# EasyEDA Pro project Hand-Exoskeleton-for-Climbing.epro

# Schematic Schematic1
Board Name: Board1; Create Date: 2025-05-13; Page Name: P1; Project Name: 设计与制造Ⅱ; Schematic Name: Schematic1; Update Date: 2025-05-13; Company: 嘉立创EDA; Page Size: A4; Version: V1.0
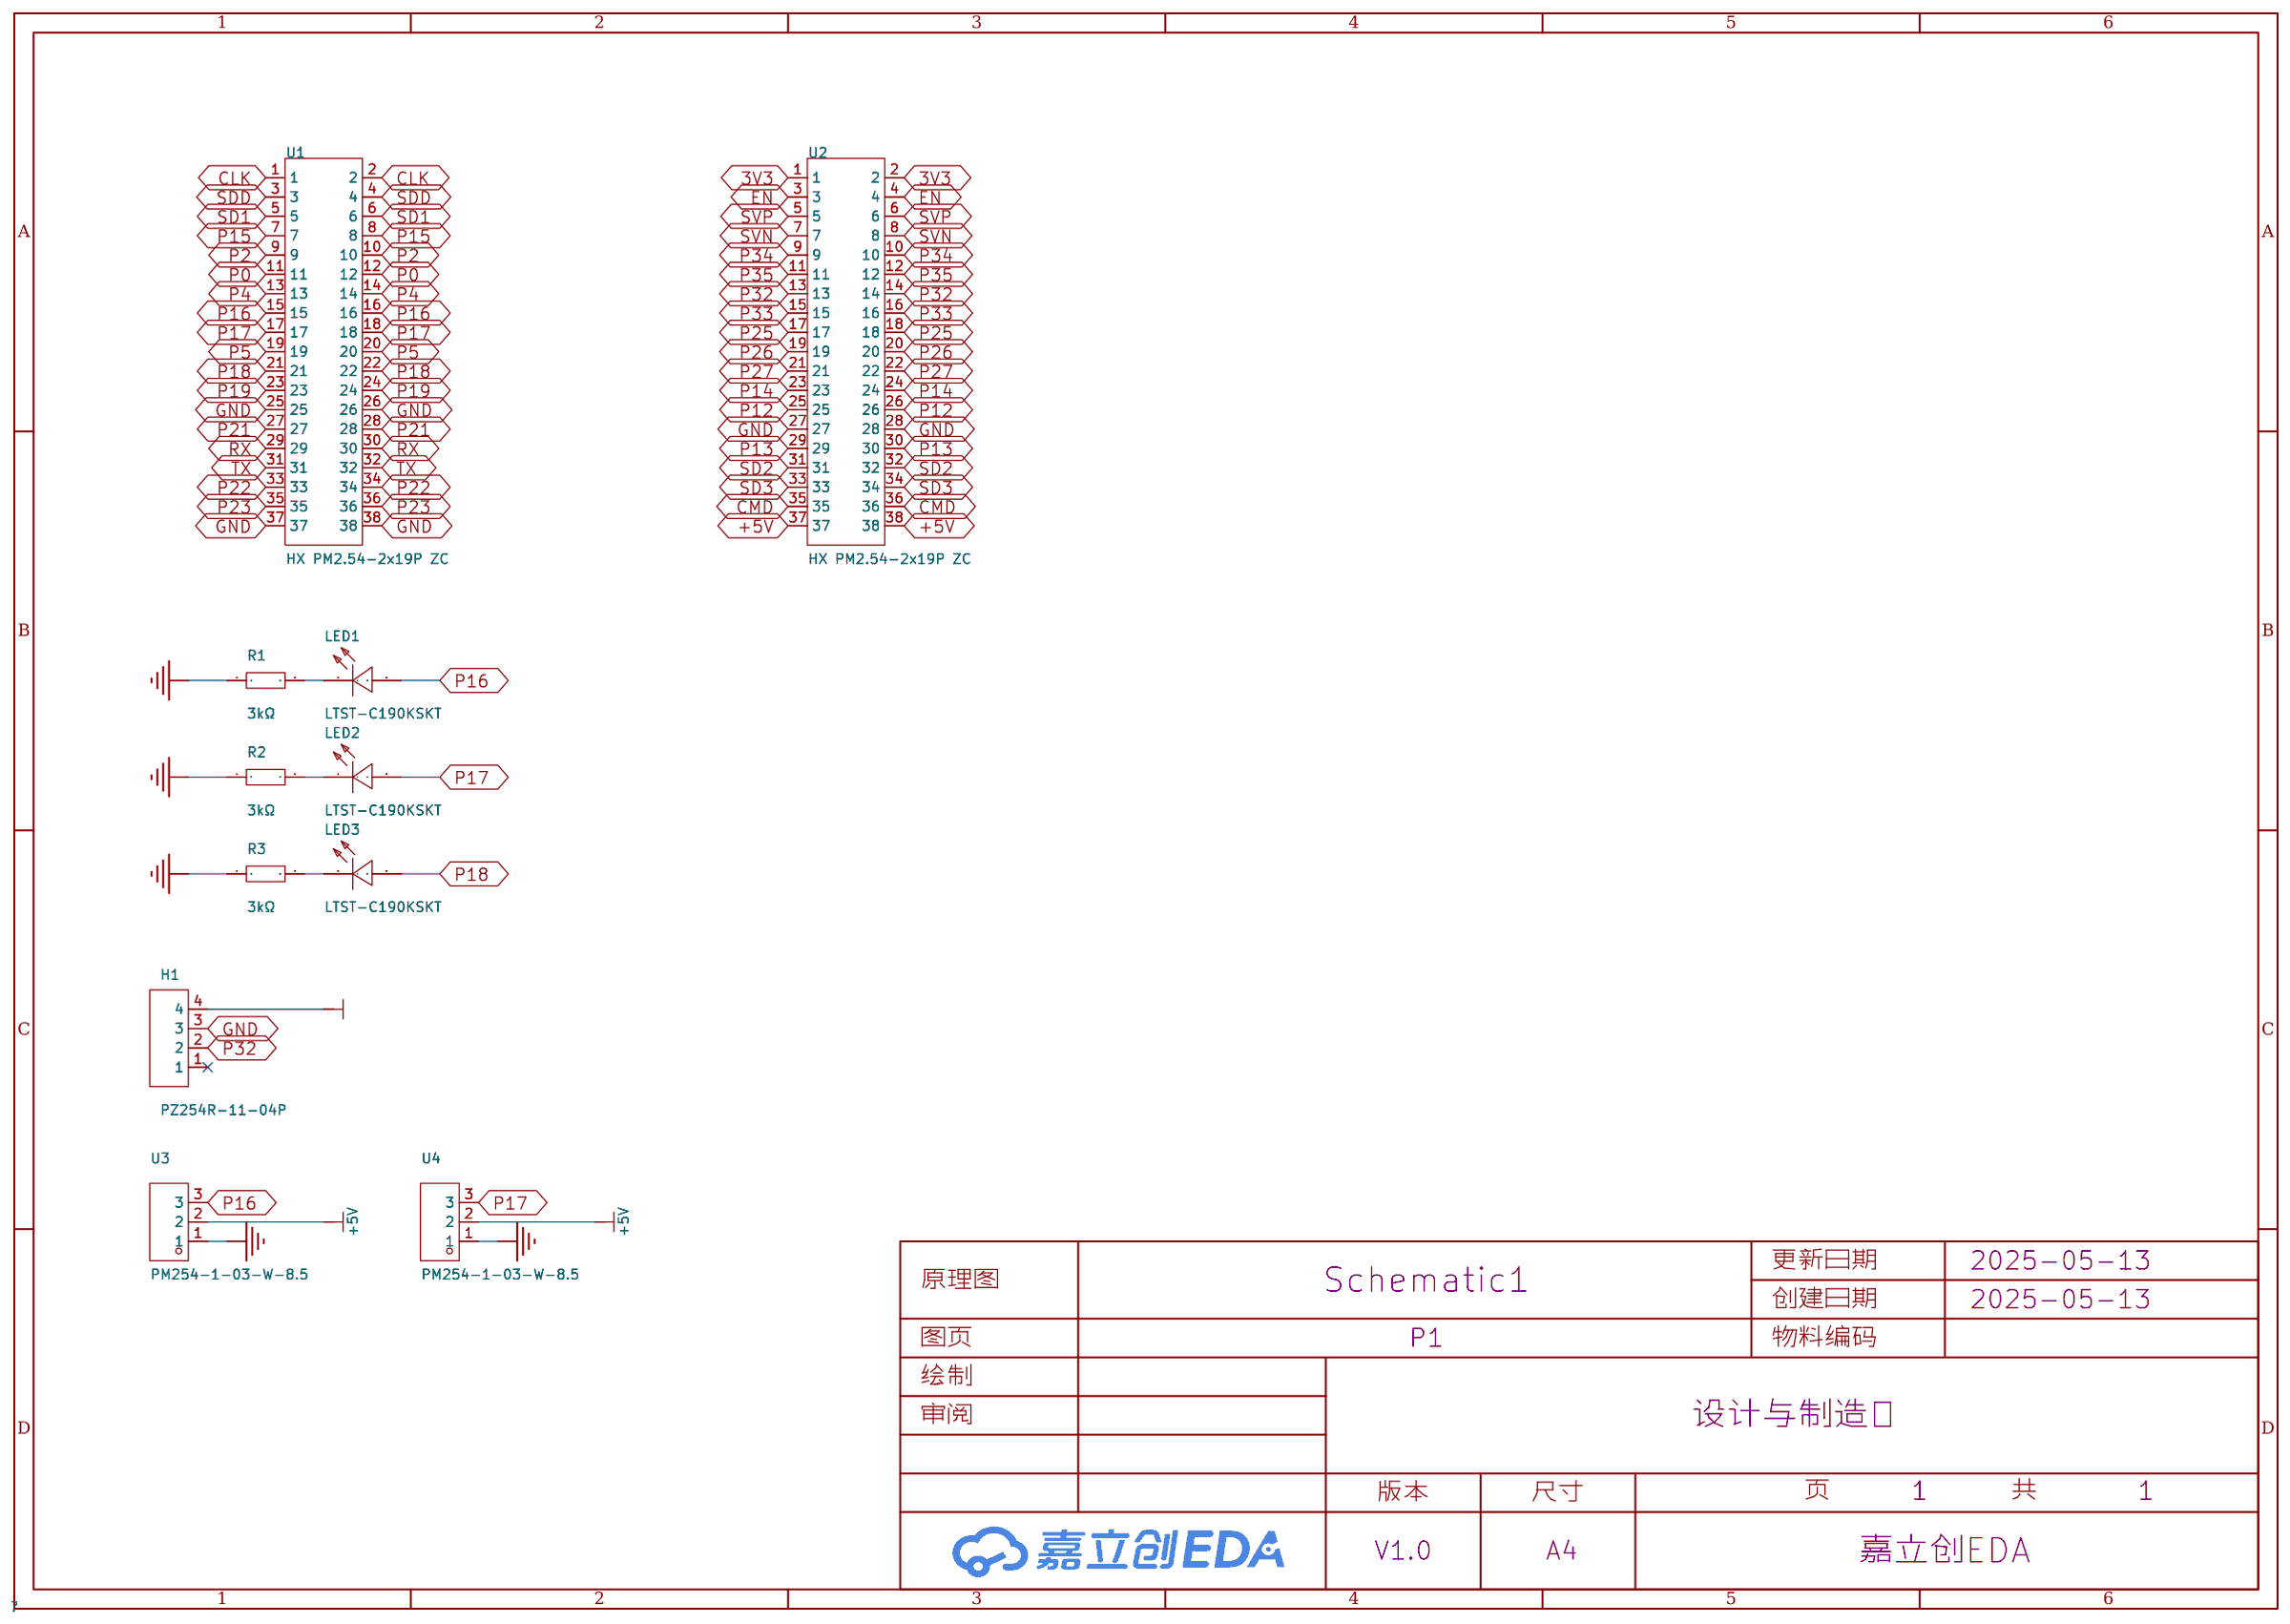
[diagram p0: schematic sheet]

## Parts
H1  PZ254R-11-04P  [HDR-TH_4P-P2.54-H-M-W10.4]
LED1  LTST-C190KSKT  [LED0603-RD]
LED2  LTST-C190KSKT  [LED0603-RD]
LED3  LTST-C190KSKT  [LED0603-RD]
R1  3kΩ  [R0603]
R2  3kΩ  [R0603]
R3  3kΩ  [R0603]
U1  HX PM2.54-2x19P ZC  [HDR-TH_38P-P2.54-V-F-R2-C19-S2.54-1]
U2  HX PM2.54-2x19P ZC  [HDR-TH_38P-P2.54-V-F-R2-C19-S2.54-1]
U3  PM254-1-03-W-8.5  [HDR-TH_3P-P2.54-H-F-W10.0-N]
U4  PM254-1-03-W-8.5  [HDR-TH_3P-P2.54-H-F-W10.0-N]

## Library data of the parts
H1 = PZ254R-11-04P: 插针结构:1x4P;间距:2.54mm;行距:-;圆针/方针:方针;安装方式:弯插;排数:单排;总PIN位数:4P;额定电流:-;额定电压:-;配合针长度:6mm;塑高:2.5mm;触头材质:黄铜;触头镀层:-;工作温度:-40℃~+105℃;颜色:黑色;; LCSC Part Name: 1x4P 间距:2.54mm 方针 弯插; Supplier Part: C492412; Manufacturer: XFCN(兴飞); Supplier Footprint: 弯插,P=2.54mm; JLCPCB Part Class: 扩展库; Datasheet: https://atta.szlcsc.com/upload/public/pdf/source/20200309/C492412_B0EFFC1946AB079B8871416C4A09EF6C.pdf; Supplier: LCSC; Pin Structure: 1x4P; Pitch: 2.54mm; Circluar Pins/Square Pins: 方针; Mounting Type: 弯插; Number of Rows: 单排; Number of Pins: 4P; Length of Mating Pin: 6mm; Insulation Height: 2.5mm; Contact Material: 黄铜; Operating Temperature: -40℃~+105℃; Color: 黑色
LED1-LED3 = LTST-C190KSKT: 发光颜色:黄色;正向电压(VF):2.1V;功率:75mW;正向电流:20mA;主波长:584.5nm~597nm;二极管配置:-;透镜颜色:无色透明透镜;色温:-;发光强度:104mcd;发光角度:130°;载带方式:-;工作温度:-30℃~+85℃;; LCSC Part Name: 黄灯; Supplier Part: C125095; Manufacturer: LITEON(光宝); Supplier Footprint: 0603; JLCPCB Part Class: 扩展库; Datasheet: https://atta.szlcsc.com/upload/public/pdf/source/20180129/C125095_15171881843821315881.pdf; Supplier: LCSC; Emitted Color: 黄色; Forward Voltage (VF): 2.1V; Power Dissipation: 75mW; Forward Current: 20mA; Dominant Wavelength: 584.5nm~597nm; Peak Wavelength: 588nm; Lens Color: 无色透明透镜; Luminous Intensity: 104mcd; Viewing Angle: 130°; Operating Temperature: -30℃~+85℃
R1-R3 = 0603WAF3001T5E: 电阻类型:厚膜电阻;阻值:3kΩ;精度:±1%;功率:100mW;工作电压:75V;温度系数:±100ppm/℃;; LCSC Part Name: 3kΩ ±1% 100mW 厚膜电阻; Supplier Part: C4211; Manufacturer: UNI-ROYAL(厚声); Supplier Footprint: 0603; JLCPCB Part Class: 基础库; Datasheet: https://atta.szlcsc.com/upload/public/pdf/source/20200306/C422600_1E6D84923E4A46A82E41ADD87F860B5C.pdf; Supplier: LCSC; Type: 厚膜电阻; Tolerance: ±1%; Power(Watts): 100mW; Voltage-Supply(Max): 75V; Temperature Coefficient: ±100ppm/℃; Operating Temperature: -55℃~+155℃
U1 U2 = HX PM2.54-2x19P ZC: 插孔结构:2x19P;间距:2.54mm;行距:2.54mm;圆孔/方孔:方孔;安装方式:直插;排数:双排;总孔位数:38P;额定电流:3A;插孔方向:顶部;塑高:8.5mm;触头镀层:金;工作温度:-40℃~+105℃;; LCSC Part Name: 间距：2.54mm 2x19P 直插排母; Supplier Part: C42372543; Manufacturer: hanxia(韩下); Supplier Footprint: 插件,P=2.54mm; Datasheet: https://atta.szlcsc.com/upload/public/pdf/source/20241030/2B81E1E23C986D3D2A350FD3367BFA9F.pdf; Supplier: LCSC; Holes Structure: 2x19P; Pitch: 2.54mm; Row Spacing: 2.54mm; Circular Hole / Square Hole: 方孔; Mounting Type: 直插; Number of Rows: 双排; Number of Positions: 38P; Current Rating: 3A; Holes Direction: 顶部; Insulation Height: 8.5mm; Contact Plating: 金; Operating Temperature: -40℃~+105℃; PIN Length: 3.2mm
U3 U4 = PM254-1-03-W-8.5: 插孔结构:1x3P;间距:2.54mm;行距:-;圆孔/方孔:方孔;安装类型:弯插;排数:单排;总孔位数:3P;额定电流:3A;额定电压:-;插孔方向:侧面;塑高:8.5mm;触头材质:铜合金;工作温度范围:-40℃~+105℃;焊接温度(最大值):260℃@5S;; LCSC Part Name: 1x3P 间距:2.54mm 弯插; Supplier Part: C2897385; Manufacturer: HCTL(华灿天禄); Supplier Footprint: 弯插,P=2.54mm; JLCPCB Part Class: 扩展库; Datasheet: https://atta.szlcsc.com/upload/public/pdf/source/20230609/7BA40A3D721268A082DCDEAD4C99131B.pdf; Supplier: LCSC; Holes Structure: 1x3P; Pitch: 2.54mm; Circular Hole / Square Hole: 方孔; Mounting Type: 弯插; Number of Rows: 单排; Number of Holes: 3P; Current Rating (Max): 3A; Holes Direction: 侧面; Insulation Height: 8.5mm; Contact Material: 铜合金; Operating Temperature Range: -40℃~+105℃; Soldering Temperature(Max): 260℃@5S

## Nets
3V3: H1.4 U2.1 U2.2
+5V: U2.37 U2.38 U3.2 U4.2
GND: H1.3 R1.1 R2.1 R3.1 U1.25 U1.26 U1.37 U1.38 U2.27 U2.28 U3.1 U4.1
CLK: U1.1 U1.2
CMD: U2.35 U2.36
EN: U2.3 U2.4
P0: U1.11 U1.12
P2: U1.9 U1.10
P4: U1.13 U1.14
P5: U1.19 U1.20
P12: U2.25 U2.26
P13: U2.29 U2.30
P14: U2.23 U2.24
P15: U1.7 U1.8
P16: LED1.2(+) U1.15 U1.16 U3.3
P17: LED2.2(+) U1.17 U1.18 U4.3
P18: LED3.2(+) U1.21 U1.22
P19: U1.23 U1.24
P21: U1.27 U1.28
P22: U1.33 U1.34
P23: U1.35 U1.36
P25: U2.17 U2.18
P26: U2.19 U2.20
P27: U2.21 U2.22
P32: H1.2 U2.13 U2.14
P33: U2.15 U2.16
P34: U2.9 U2.10
P35: U2.11 U2.12
RX: U1.29 U1.30
SD1: U1.5 U1.6
SD2: U2.31 U2.32
SD3: U2.33 U2.34
SDD: U1.3 U1.4
SVN: U2.7 U2.8
SVP: U2.5 U2.6
TX: U1.31 U1.32
$1N1874: LED1.1(-) R1.2
$1N1990: LED2.1(-) R2.2
$1N2241: LED3.1(-) R3.2

Not connected (* = marked no-connect by the designer): H1 1*

# Board PCB1
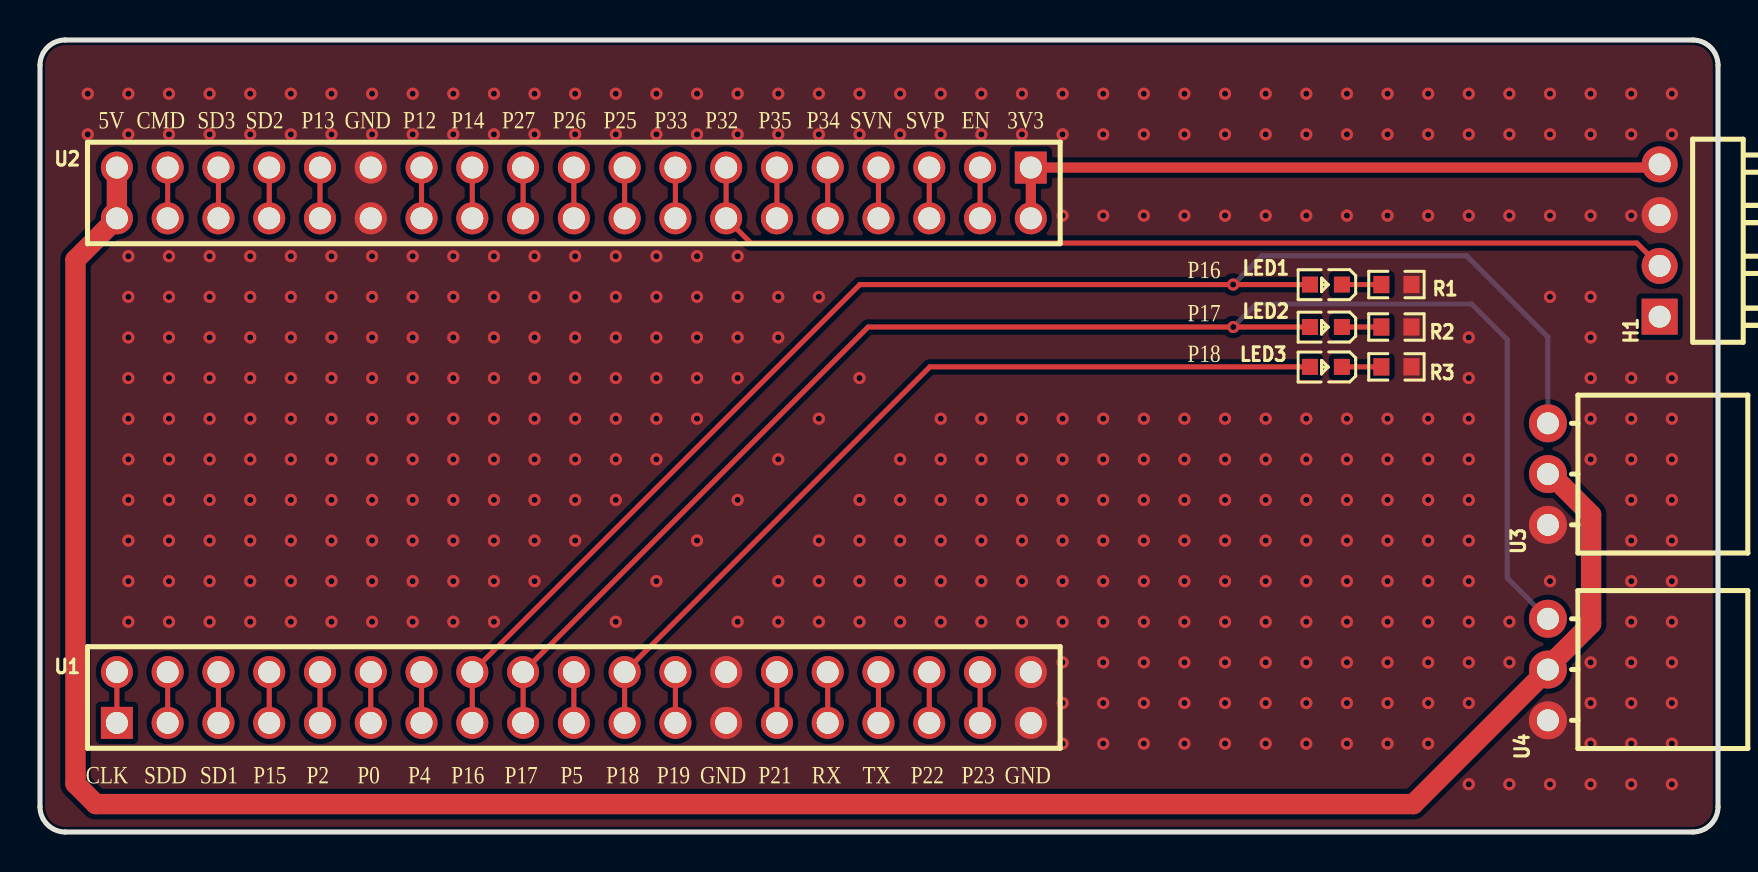
[diagram p1: board, top side]
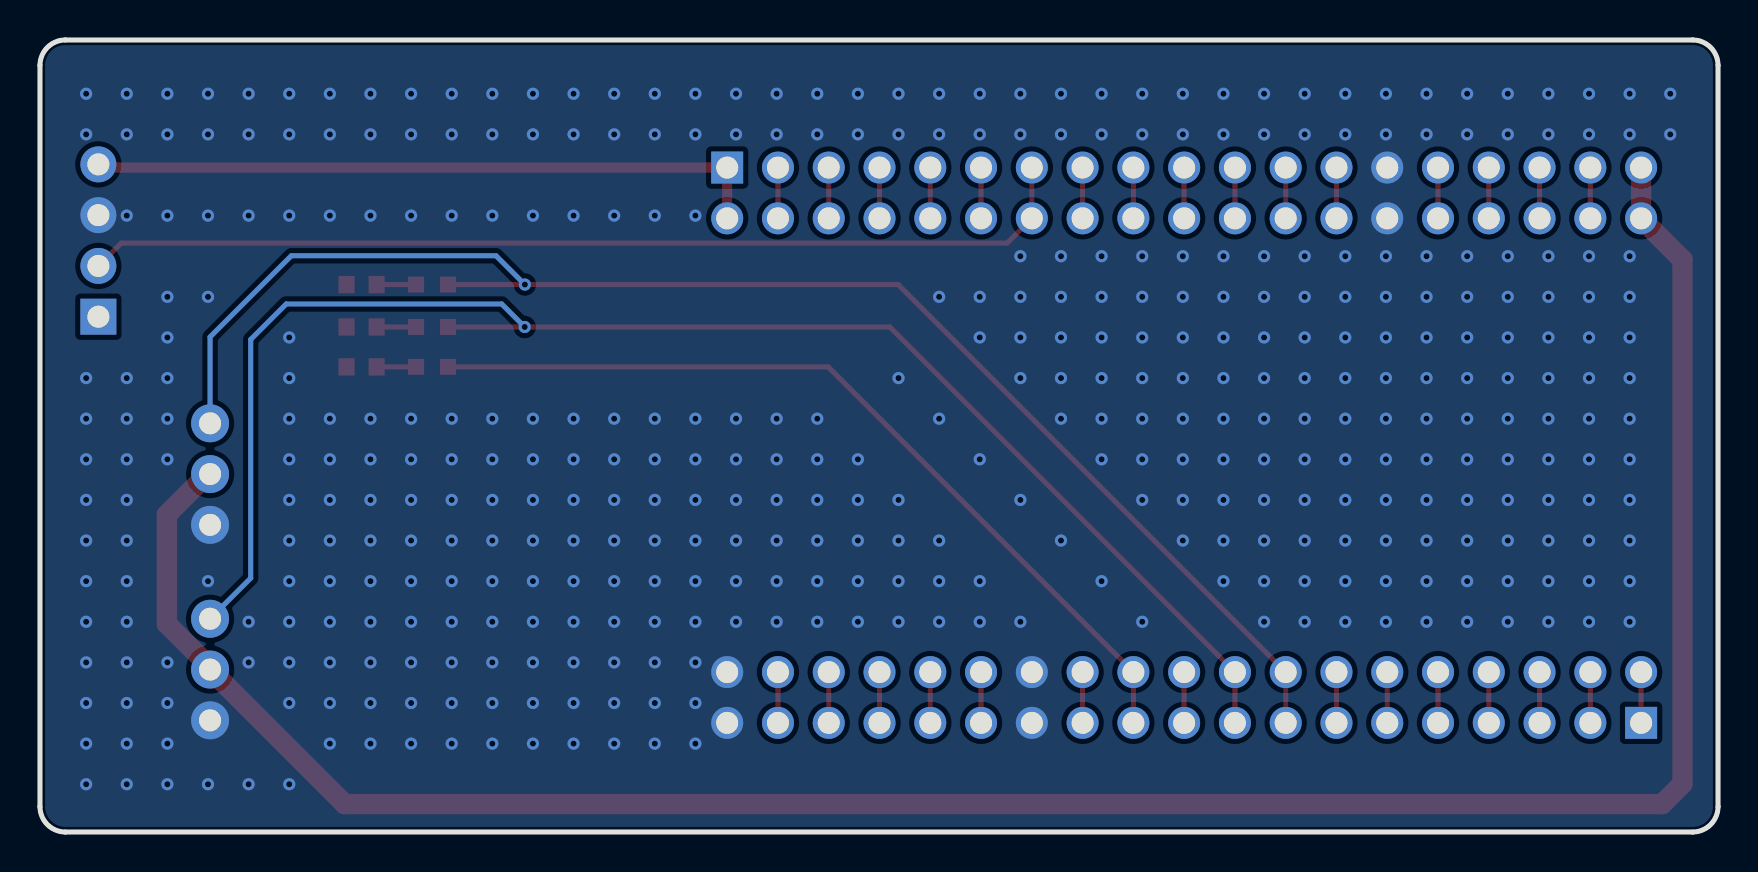
[diagram p2: board, bottom side, seen from below]

Outline 83.95 x 39.62 mm; copper layers: Top Layer, Bottom Layer. Coordinates in mm from the lower left corner of the outline.
Outline path: 0,38.35 0,1.27 arc(0.37,0.37) 1.27,0 82.68,0 arc(83.58,0.37) 83.95,1.27 83.95,38.35 arc(83.58,39.25) 82.68,39.62 1.27,39.62 arc(0.37,39.25) 0,38.35
Stack: Top Layer 0.035mm / Dielectric1 1.51mm FR4 er 4.5 / Bottom Layer 0.035mm

## Design rules (mm)
template: 直连铺铜
spacing copperThickness1oz (default): track to track 0.102, other pairs 0.152 to 0.3
spacing copperThickness2oz: track to track 0.203, other pairs 0.152 to 0.3
track width copperThickness1oz (default): min 0.127, default 0.254, max 2.54
track width copperThickness2oz: min 0.203, default 0.254, max 2.54
differential pair differentialPair (default): width min 0.127, default 0.254, max 2.54; gap min 0.152, default 0.152
via viaSize (default): diameter min 0.5, default 0.61, max 10; hole min 0.3, default 0.305, max 6.3

## Placement (name value [footprint] x y rotation side)
H1  PZ254R-11-04P  [HDR-TH_4P-P2.54-H-M-W10.4]  81.03 29.59 90 top
LED1  LTST-C190KSKT  [LED0603-RD]  64.33 27.39 180 top
LED2  LTST-C190KSKT  [LED0603-RD]  64.33 25.27 180 top
LED3  LTST-C190KSKT  [LED0603-RD]  64.33 23.27 180 top
R1  3kΩ  [R0603]  67.86 27.39 180 top
R2  3kΩ  [R0603]  67.86 25.27 180 top
R3  3kΩ  [R0603]  67.86 23.27 180 top
U1  HX PM2.54-2x19P ZC  [HDR-TH_38P-P2.54-V-F-R2-C19-S2.54-1]  26.71 6.73 0 top
U2  HX PM2.54-2x19P ZC  [HDR-TH_38P-P2.54-V-F-R2-C19-S2.54-1]  26.71 31.97 180 top
U3  PM254-1-03-W-8.5  [HDR-TH_3P-P2.54-H-F-W10.0-N]  75.44 17.91 90 top
U4  PM254-1-03-W-8.5  [HDR-TH_3P-P2.54-H-F-W10.0-N]  75.44 8.13 90 top

## Footprints (pads in the part's own frame, mm; a bottom-side part is the same pattern mirrored in y, then rotated)
HDR-TH_3P-P2.54-H-F-W10.0-N
  round 1.9 hole 1.1: 1(-2.54,0) 2(0,0) 3(2.54,0)
HDR-TH_4P-P2.54-H-M-W10.4
  rect 1.8x1.8 hole 1.1: 1(-3.81,0)
  round 1.8 hole 1.1: 2(-1.27,0) 3(1.27,0) 4(3.81,0)
HDR-TH_38P-P2.54-V-F-R2-C19-S2.54-1
  rect 1.6x1.6 hole 1.1: 1(-22.86,-1.27)
  round 1.6 hole 1.1: 2(-22.86,1.27) 3(-20.32,-1.27) 4(-20.32,1.27) 5(-17.78,-1.27) 6(-17.78,1.27) 7(-15.24,-1.27) 8(-15.24,1.27) 9(-12.7,-1.27) 10(-12.7,1.27) 11(-10.16,-1.27) 12(-10.16,1.27) 13(-7.62,-1.27) 14(-7.62,1.27) 15(-5.08,-1.27) 16(-5.08,1.27) 17(-2.54,-1.27) 18(-2.54,1.27) 19(0,-1.27) 20(0,1.27) 21(2.54,-1.27) 22(2.54,1.27) 23(5.08,-1.27) 24(5.08,1.27) 25(7.62,-1.27) 26(7.62,1.27) 27(10.16,-1.27) 28(10.16,1.27) 29(12.7,-1.27) 30(12.7,1.27) 31(15.24,-1.27) 32(15.24,1.27) 33(17.78,-1.27) 34(17.78,1.27) 35(20.32,-1.27) 36(20.32,1.27) 37(22.86,-1.27) 38(22.86,1.27)
LED0603-RD
  rect 0.8x0.8 smd: 1(-0.799,0) 2(0.799,0)
R0603
  rect 0.806x0.864 smd: 1(-0.753,0) 2(0.753,0)

## Nets
As in the schematic.

Pads without a net: H1 1

## Via types
v1: diameter 0.61, hole 0.305, Top Layer to Bottom Layer, 417 vias

## Routing (per net, layer and track width the routed paths; a pad name or vN(x,y) marks a point on that pad's centre or on a via; arc(x,y) is an arc through that point)
3V3: length 34.1
  Top Layer w0.508: U2.2 U2.1 80.87,33.24 H1.4
+5V: length 120.2
  Top Layer w1.016: U3.2 75.57,17.91 77.6,15.88 77.6,10.41 75.44,8.26 U4.2 68.71,1.4 2.79,1.4 1.78,2.41 1.78,28.63 U2.38 U2.37
GND:
  vias: v1(2.39,36.93) v1(2.39,34.9) v1(4.42,36.93) v1(4.42,34.9) v1(4.42,28.81) v1(4.42,26.77) v1(4.42,24.74) v1(4.42,22.71) v1(4.42,20.68) v1(4.42,18.65) v1(4.42,16.61) v1(4.42,14.58) v1(4.42,12.55) v1(4.42,10.52) v1(6.45,36.93) v1(6.45,34.9) v1(6.45,28.81) v1(6.45,26.77) v1(6.45,24.74) v1(6.45,22.71) v1(6.45,20.68) v1(6.45,18.65) v1(6.45,16.61) v1(6.45,14.58) v1(6.45,12.55) v1(6.45,10.52) v1(8.49,36.93) v1(8.49,34.9) v1(8.49,28.81) v1(8.49,26.77) v1(8.49,24.74) v1(8.49,22.71) v1(8.49,20.68) v1(8.49,18.65) v1(8.49,16.61) v1(8.49,14.58) v1(8.49,12.55) v1(8.49,10.52) v1(10.52,36.93) v1(10.52,34.9) v1(10.52,28.81) v1(10.52,26.77) v1(10.52,24.74) v1(10.52,22.71) v1(10.52,20.68) v1(10.52,18.65) v1(10.52,16.61) v1(10.52,14.58) v1(10.52,12.55) v1(10.52,10.52) v1(12.55,36.93) v1(12.55,34.9) v1(12.55,28.81) v1(12.55,26.77) v1(12.55,24.74) v1(12.55,22.71) v1(12.55,20.68) v1(12.55,18.65) v1(12.55,16.61) v1(12.55,14.58) v1(12.55,12.55) v1(12.55,10.52) v1(14.58,36.93) v1(14.58,34.9) v1(14.58,28.81) v1(14.58,26.77) v1(14.58,24.74) v1(14.58,22.71) v1(14.58,20.68) v1(14.58,18.65) v1(14.58,16.61) v1(14.58,14.58) v1(14.58,12.55) v1(14.58,10.52) v1(16.61,36.93) v1(16.61,34.9) v1(16.61,28.81) v1(16.61,26.77) v1(16.61,24.74) v1(16.61,22.71) v1(16.61,20.68) v1(16.61,18.65) v1(16.61,16.61) v1(16.61,14.58) v1(16.61,12.55) v1(16.61,10.52) v1(18.65,36.93) v1(18.65,34.9) v1(18.65,28.81) v1(18.65,26.77) v1(18.65,24.74) v1(18.65,22.71) v1(18.65,20.68) v1(18.65,18.65) v1(18.65,16.61) v1(18.65,14.58) v1(18.65,12.55) v1(18.65,10.52) v1(20.68,36.93) v1(20.68,34.9) v1(20.68,28.81) v1(20.68,26.77) v1(20.68,24.74) v1(20.68,22.71) v1(20.68,20.68) v1(20.68,18.65) v1(20.68,16.61) v1(20.68,14.58) v1(20.68,12.55) v1(20.68,10.52) v1(22.71,36.93) v1(22.71,34.9) v1(22.71,28.81) v1(22.71,26.77) v1(22.71,24.74) v1(22.71,22.71) v1(22.71,20.68) v1(22.71,18.65) v1(22.71,16.61) v1(22.71,14.58) v1(22.71,12.55) v1(22.71,10.52) v1(24.74,36.93) v1(24.74,34.9) v1(24.74,28.81) v1(24.74,26.77) v1(24.74,24.74) v1(24.74,22.71) v1(24.74,20.68) v1(24.74,18.65) v1(24.74,16.61) v1(24.74,14.58) v1(24.74,12.55) v1(26.77,36.93) v1(26.77,34.9) v1(26.77,28.81) v1(26.77,26.77) v1(26.77,24.74) v1(26.77,22.71) v1(26.77,20.68) v1(26.77,18.65) v1(26.77,16.61) v1(26.77,14.58) v1(28.81,36.93) v1(28.81,34.9) v1(28.81,28.81) v1(28.81,26.77) v1(28.81,24.74) v1(28.81,22.71) v1(28.81,20.68) v1(28.81,18.65) v1(28.81,16.61) v1(28.81,10.52) v1(30.84,36.93) v1(30.84,34.9) v1(30.84,28.81) v1(30.84,26.77) v1(30.84,24.74) v1(30.84,22.71) v1(30.84,20.68) v1(30.84,18.65) v1(30.84,12.55) v1(32.87,36.93) v1(32.87,34.9) v1(32.87,28.81) v1(32.87,26.77) v1(32.87,24.74) v1(32.87,22.71) v1(32.87,20.68) v1(32.87,14.58) v1(34.9,36.93) v1(34.9,34.9) v1(34.9,28.81) v1(34.9,26.77) v1(34.9,24.74) v1(34.9,22.71) v1(34.9,16.61) v1(34.9,10.52) v1(36.93,36.93) v1(36.93,34.9) v1(36.93,26.77) v1(36.93,24.74) v1(36.93,18.65) v1(36.93,12.55) v1(36.93,10.52) v1(38.97,36.93) v1(38.97,34.9) v1(38.97,26.77) v1(38.97,20.68) v1(38.97,14.58) v1(38.97,12.55) v1(38.97,10.52) v1(41,36.93) v1(41,34.9) v1(41,22.71) v1(41,16.61) v1(41,14.58) v1(41,12.55) v1(41,10.52) v1(43.03,36.93) v1(43.03,34.9) v1(43.03,18.65) v1(43.03,16.61) v1(43.03,14.58) v1(43.03,12.55) v1(43.03,10.52) v1(45.06,36.93) v1(45.06,34.9) v1(45.06,20.68) v1(45.06,18.65) v1(45.06,16.61) v1(45.06,14.58) v1(45.06,12.55) v1(45.06,10.52) v1(47.09,36.93) v1(47.09,34.9) v1(47.09,20.68) v1(47.09,18.65) v1(47.09,16.61) v1(47.09,14.58) v1(47.09,12.55) v1(47.09,10.52) v1(49.13,36.93) v1(49.13,34.9) v1(49.13,20.68) v1(49.13,18.65) v1(49.13,16.61) v1(49.13,14.58) v1(49.13,12.55) v1(49.13,10.52) v1(51.16,36.93) v1(51.16,34.9) v1(51.16,30.84) v1(51.16,20.68) v1(51.16,18.65) v1(51.16,16.61) v1(51.16,14.58) v1(51.16,12.55) v1(51.16,10.52) v1(51.16,8.49) v1(51.16,6.45) v1(51.16,4.42) v1(53.19,36.93) v1(53.19,34.9) v1(53.19,30.84) v1(53.19,20.68) v1(53.19,18.65) v1(53.19,16.61) v1(53.19,14.58) v1(53.19,12.55) v1(53.19,10.52) v1(53.19,8.49) v1(53.19,6.45) v1(53.19,4.42) v1(55.22,36.93) v1(55.22,34.9) v1(55.22,30.84) v1(55.22,20.68) v1(55.22,18.65) v1(55.22,16.61) v1(55.22,14.58) v1(55.22,12.55) v1(55.22,10.52) v1(55.22,8.49) v1(55.22,6.45) v1(55.22,4.42) v1(57.25,36.93) v1(57.25,34.9) v1(57.25,30.84) v1(57.25,20.68) v1(57.25,18.65) v1(57.25,16.61) v1(57.25,14.58) v1(57.25,12.55) v1(57.25,10.52) v1(57.25,8.49) v1(57.25,6.45) v1(57.25,4.42) v1(59.29,36.93) v1(59.29,34.9) v1(59.29,30.84) v1(59.29,20.68) v1(59.29,18.65) v1(59.29,16.61) v1(59.29,14.58) v1(59.29,12.55) v1(59.29,10.52) v1(59.29,8.49) v1(59.29,6.45) v1(59.29,4.42) v1(61.32,36.93) v1(61.32,34.9) v1(61.32,30.84) v1(61.32,20.68) v1(61.32,18.65) v1(61.32,16.61) v1(61.32,14.58) v1(61.32,12.55) v1(61.32,10.52) v1(61.32,8.49) v1(61.32,6.45) v1(61.32,4.42) v1(63.35,36.93) v1(63.35,34.9) v1(63.35,30.84) v1(63.35,20.68) v1(63.35,18.65) v1(63.35,16.61) v1(63.35,14.58) v1(63.35,12.55) v1(63.35,10.52) v1(63.35,8.49) v1(63.35,6.45) v1(63.35,4.42) v1(65.38,36.93) v1(65.38,34.9) v1(65.38,30.84) v1(65.38,20.68) v1(65.38,18.65) v1(65.38,16.61) v1(65.38,14.58) v1(65.38,12.55) v1(65.38,10.52) v1(65.38,8.49) v1(65.38,6.45) v1(65.38,4.42) v1(67.41,36.93) v1(67.41,34.9) v1(67.41,30.84) v1(67.41,20.68) v1(67.41,18.65) v1(67.41,16.61) v1(67.41,14.58) v1(67.41,12.55) v1(67.41,10.52) v1(67.41,8.49) v1(67.41,6.45) v1(67.41,4.42) v1(69.45,36.93) v1(69.45,34.9) v1(69.45,30.84) v1(69.45,20.68) v1(69.45,18.65) v1(69.45,16.61) v1(69.45,14.58) v1(69.45,12.55) v1(69.45,10.52) v1(69.45,8.49) v1(69.45,6.45) v1(69.45,4.42) v1(71.48,36.93) v1(71.48,34.9) v1(71.48,30.84) v1(71.48,24.74) v1(71.48,22.71) v1(71.48,20.68) v1(71.48,18.65) v1(71.48,16.61) v1(71.48,14.58) v1(71.48,12.55) v1(71.48,10.52) v1(71.48,8.49) v1(71.48,6.45) v1(71.48,2.39) v1(73.51,36.93) v1(73.51,34.9) v1(73.51,30.84) v1(73.51,10.52) v1(73.51,8.49) v1(73.51,2.39) v1(75.54,36.93) v1(75.54,34.9) v1(75.54,30.84) v1(75.54,26.77) v1(75.54,12.55) v1(75.54,2.39) v1(77.57,36.93) v1(77.57,34.9) v1(77.57,30.84) v1(77.57,26.77) v1(77.57,24.74) v1(77.57,22.71) v1(77.57,20.68) v1(77.57,18.65) v1(77.57,8.49) v1(77.57,6.45) v1(77.57,4.42) v1(77.57,2.39) v1(79.61,36.93) v1(79.61,34.9) v1(79.61,30.84) v1(79.61,22.71) v1(79.61,20.68) v1(79.61,18.65) v1(79.61,16.61) v1(79.61,14.58) v1(79.61,12.55) v1(79.61,10.52) v1(79.61,8.49) v1(79.61,6.45) v1(79.61,4.42) v1(79.61,2.39) v1(81.64,36.93) v1(81.64,34.9) v1(81.64,22.71) v1(81.64,20.68) v1(81.64,18.65) v1(81.64,16.61) v1(81.64,14.58) v1(81.64,12.55) v1(81.64,10.52) v1(81.64,8.49) v1(81.64,6.45) v1(81.64,4.42) v1(81.64,2.39)
CLK: length 2.5
  Top Layer w0.254: U1.2 U1.1
CMD: length 2.5
  Top Layer w0.254: U2.35 U2.36
EN: length 2.5
  Top Layer w0.254: U2.3 U2.4
P0: length 2.5
  Top Layer w0.254: U1.12 U1.11
P2: length 2.5
  Top Layer w0.254: U1.10 U1.9
P4: length 2.5
  Top Layer w0.254: U1.14 U1.13
P5: length 2.5
  Top Layer w0.254: U1.20 U1.19
P12: length 2.5
  Top Layer w0.254: U2.25 U2.26
P13: length 2.5
  Top Layer w0.254: U2.29 U2.30
P14: length 2.5
  Top Layer w0.254: U2.23 U2.24
P15: length 2.5
  Top Layer w0.254: U1.8 U1.7
P16: length 74.8
  Top Layer w0.254: U1.15 U1.16 41.02,27.39 v1(59.69,27.39) LED1.2
  Bottom Layer w0.254: v1(59.69,27.39) 61.13,28.83 71.37,28.83 75.44,24.77 U3.3
P17: length 78.8
  Top Layer w0.254: U1.17 U1.18 41.43,25.27 v1(59.7,25.27) LED2.2
  Bottom Layer w0.254: v1(59.7,25.27) 60.85,26.42 71.63,26.42 73.41,24.64 73.41,12.7 U4.3
P18: length 43.1
  Top Layer w0.254: U1.21 U1.22 44.52,23.27 LED3.2
P19: length 2.5
  Top Layer w0.254: U1.24 U1.23
P21: length 2.5
  Top Layer w0.254: U1.28 U1.27
P22: length 2.5
  Top Layer w0.254: U1.34 U1.33
P23: length 2.5
  Top Layer w0.254: U1.36 U1.35
P25: length 2.5
  Top Layer w0.254: U2.17 U2.18
P26: length 2.5
  Top Layer w0.254: U2.19 U2.20
P27: length 2.5
  Top Layer w0.254: U2.21 U2.22
P32: length 50.2
  Top Layer w0.254: H1.2 79.88,29.46 35.57,29.46 U2.14 U2.13
P33: length 2.5
  Top Layer w0.254: U2.15 U2.16
P34: length 2.5
  Top Layer w0.254: U2.9 U2.10
P35: length 2.5
  Top Layer w0.254: U2.11 U2.12
RX: length 2.5
  Top Layer w0.254: U1.30 U1.29
SD1: length 2.5
  Top Layer w0.254: U1.6 U1.5
SD2: length 2.5
  Top Layer w0.254: U2.31 U2.32
SD3: length 2.5
  Top Layer w0.254: U2.33 U2.34
SDD: length 2.5
  Top Layer w0.254: U1.4 U1.3
SVN: length 2.5
  Top Layer w0.254: U2.7 U2.8
SVP: length 2.5
  Top Layer w0.254: U2.5 U2.6
TX: length 2.5
  Top Layer w0.254: U1.32 U1.31
$1N1874: length 2
  Top Layer w0.254: LED1.1 R1.2
$1N1990: length 2
  Top Layer w0.254: LED2.1 R2.2
$1N2241: length 2
  Top Layer w0.254: 65.13,23.27 67.1,23.27

## Copper pours and planes (outline as drawn; the poured copper is in the pictures)
GND on Top Layer: -2.03,42.93 86.99,42.93 86.99,-3.05 -2.03,-3.05
GND on Bottom Layer: -2.41,42.29 87.5,42.29 87.5,-3.05 -2.41,-3.05

## Text on the board
Top Silkscreen Layer: CLK | 5V | CMD | SDD | SD3 | SD1 | SD2 | P15 | P13 | P2 | GND | P0 | P12 | P4 | P14 | P16 | P27 | P17 | P26 | P5 | P25 | P18 | P33 | P19 | P32 | P35 | P21 | P34 | RX | SVN | TX | SVP | P22 | EN | P23 | 3V3
